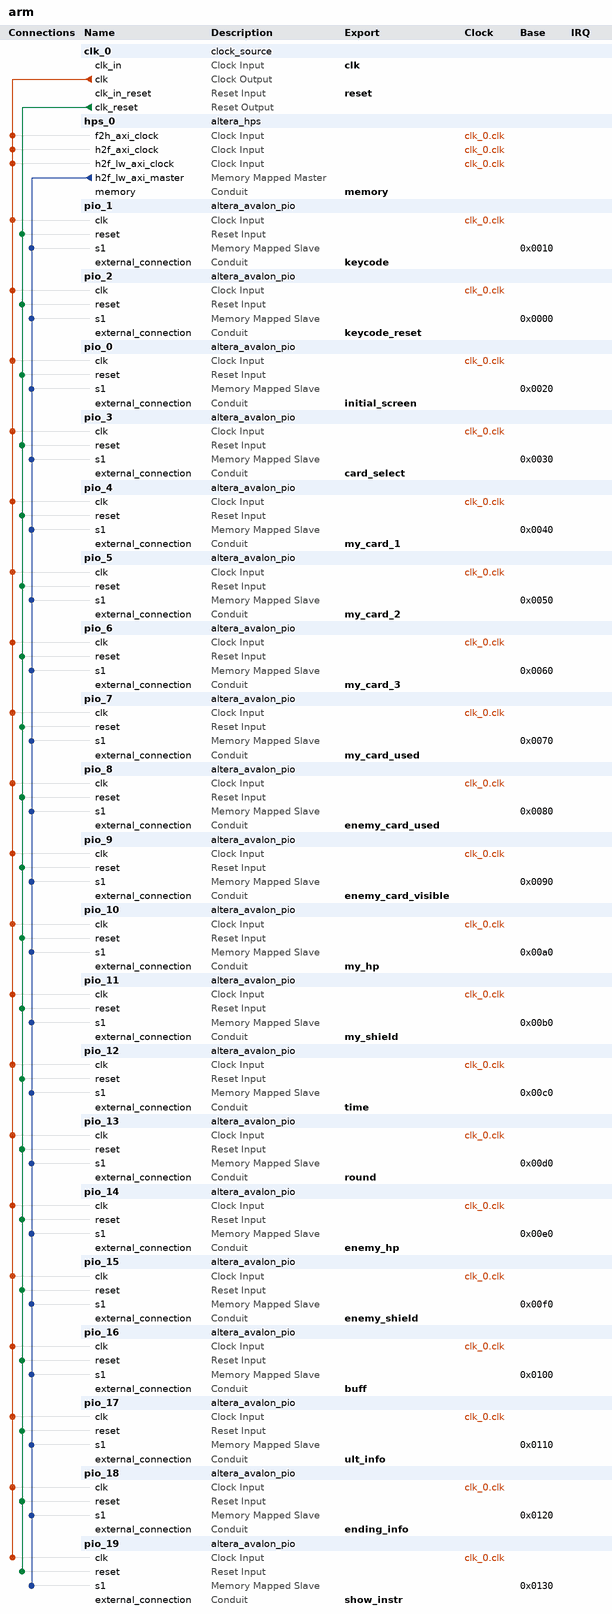
[diagram p0: system contents]
# Platform Designer (Qsys) system arm, Cyclone V 5CSEMA5F31C6
# Parameters at their usual value, and those the tool derives, are not listed.
package require -exact qsys 19.1
create_system arm
set_project_property DEVICE_FAMILY {Cyclone V}
set_project_property DEVICE 5CSEMA5F31C6

add_instance clk_0 clock_source 19.1
set_instance_parameter_value clk_0 clockFrequency 50000000

add_instance hps_0 altera_hps 19.1
set_instance_parameter_value hps_0 EMAC1_Mode N/A
set_instance_parameter_value hps_0 EMAC1_PinMuxing Unused
set_instance_parameter_value hps_0 F2SCLK_COLDRST_Enable false
set_instance_parameter_value hps_0 F2SCLK_DBGRST_Enable false
set_instance_parameter_value hps_0 F2SCLK_WARMRST_Enable false
set_instance_parameter_value hps_0 F2SINTERRUPT_Enable false
set_instance_parameter_value hps_0 F2S_Width 2
set_instance_parameter_value hps_0 FPGA_PERIPHERAL_OUTPUT_CLOCK_FREQ_EMAC0_GTX_CLK 125
set_instance_parameter_value hps_0 FPGA_PERIPHERAL_OUTPUT_CLOCK_FREQ_EMAC0_MD_CLK 2.5
set_instance_parameter_value hps_0 FPGA_PERIPHERAL_OUTPUT_CLOCK_FREQ_EMAC1_GTX_CLK 125
set_instance_parameter_value hps_0 FPGA_PERIPHERAL_OUTPUT_CLOCK_FREQ_EMAC1_MD_CLK 2.5
set_instance_parameter_value hps_0 HPS_PROTOCOL DDR3
set_instance_parameter_value hps_0 I2C0_Mode N/A
set_instance_parameter_value hps_0 I2C0_PinMuxing Unused
set_instance_parameter_value hps_0 I2C1_Mode N/A
set_instance_parameter_value hps_0 I2C1_PinMuxing Unused
set_instance_parameter_value hps_0 LWH2F_Enable true
set_instance_parameter_value hps_0 MEM_BANKADDR_WIDTH 3
set_instance_parameter_value hps_0 MEM_CLK_FREQ 400.0
set_instance_parameter_value hps_0 MEM_COL_ADDR_WIDTH 10
set_instance_parameter_value hps_0 MEM_DQ_WIDTH 32
set_instance_parameter_value hps_0 MEM_DRV_STR RZQ/6
set_instance_parameter_value hps_0 MEM_ROW_ADDR_WIDTH 15
set_instance_parameter_value hps_0 MEM_RTT_NOM RZQ/6
set_instance_parameter_value hps_0 MEM_RTT_WR {Dynamic ODT off}
set_instance_parameter_value hps_0 MEM_TCL 7
set_instance_parameter_value hps_0 MEM_TFAW_NS 45.0
set_instance_parameter_value hps_0 MEM_TRAS_NS 36.0
set_instance_parameter_value hps_0 MEM_TRCD_NS 13.125
set_instance_parameter_value hps_0 MEM_TRFC_NS 300.0
set_instance_parameter_value hps_0 MEM_TRP_NS 13.125
set_instance_parameter_value hps_0 MEM_VENDOR Micron
set_instance_parameter_value hps_0 MEM_WTCL 7
set_instance_parameter_value hps_0 QSPI_Mode N/A
set_instance_parameter_value hps_0 QSPI_PinMuxing Unused
set_instance_parameter_value hps_0 REF_CLK_FREQ 25.0
set_instance_parameter_value hps_0 S2FCLK_USER2CLK 5
set_instance_parameter_value hps_0 S2F_Width 3
set_instance_parameter_value hps_0 SDIO_Mode N/A
set_instance_parameter_value hps_0 SDIO_PinMuxing Unused
set_instance_parameter_value hps_0 SPIM1_Mode N/A
set_instance_parameter_value hps_0 SPIM1_PinMuxing Unused
set_instance_parameter_value hps_0 STM_Enable false
set_instance_parameter_value hps_0 TIMING_BOARD_AC_SKEW 0.02
set_instance_parameter_value hps_0 TIMING_BOARD_AC_TO_CK_SKEW 0.0
set_instance_parameter_value hps_0 TIMING_BOARD_DQ_TO_DQS_SKEW 0.0
set_instance_parameter_value hps_0 TIMING_BOARD_MAX_CK_DELAY 0.6
set_instance_parameter_value hps_0 TIMING_BOARD_MAX_DQS_DELAY 0.6
set_instance_parameter_value hps_0 TIMING_BOARD_SKEW_BETWEEN_DQS 0.02
set_instance_parameter_value hps_0 TIMING_BOARD_SKEW_CKDQS_DIMM_MAX 0.01
set_instance_parameter_value hps_0 TIMING_BOARD_SKEW_CKDQS_DIMM_MIN -0.01
set_instance_parameter_value hps_0 TIMING_BOARD_SKEW_WITHIN_DQS 0.02
set_instance_parameter_value hps_0 TIMING_TDH 65
set_instance_parameter_value hps_0 TIMING_TDQSCK 255
set_instance_parameter_value hps_0 TIMING_TDQSQ 125
set_instance_parameter_value hps_0 TIMING_TDS 30
set_instance_parameter_value hps_0 TIMING_TIH 140
set_instance_parameter_value hps_0 TIMING_TIS 190
set_instance_parameter_value hps_0 TIMING_TQSH 0.4
set_instance_parameter_value hps_0 UART0_Mode N/A
set_instance_parameter_value hps_0 UART0_PinMuxing Unused
set_instance_parameter_value hps_0 USB1_Mode N/A
set_instance_parameter_value hps_0 USB1_PinMuxing Unused
set_instance_parameter_value hps_0 desired_cfg_clk_mhz 100.0
set_instance_parameter_value hps_0 desired_qspi_clk_mhz 400.0

add_instance pio_1 altera_avalon_pio 19.1
set_instance_parameter_value pio_1 direction Input
set_instance_parameter_value pio_1 width 32

add_instance pio_2 altera_avalon_pio 19.1
set_instance_parameter_value pio_2 direction Output
set_instance_parameter_value pio_2 width 32

add_instance pio_0 altera_avalon_pio 19.1
set_instance_parameter_value pio_0 direction Output
set_instance_parameter_value pio_0 width 8

add_instance pio_3 altera_avalon_pio 19.1
set_instance_parameter_value pio_3 direction Output
set_instance_parameter_value pio_3 width 8

add_instance pio_4 altera_avalon_pio 19.1
set_instance_parameter_value pio_4 direction Output
set_instance_parameter_value pio_4 width 8

add_instance pio_5 altera_avalon_pio 19.1
set_instance_parameter_value pio_5 direction Output
set_instance_parameter_value pio_5 width 8

add_instance pio_6 altera_avalon_pio 19.1
set_instance_parameter_value pio_6 direction Output
set_instance_parameter_value pio_6 width 8

add_instance pio_7 altera_avalon_pio 19.1
set_instance_parameter_value pio_7 direction Output
set_instance_parameter_value pio_7 width 8

add_instance pio_8 altera_avalon_pio 19.1
set_instance_parameter_value pio_8 direction Output
set_instance_parameter_value pio_8 width 8

add_instance pio_9 altera_avalon_pio 19.1
set_instance_parameter_value pio_9 direction Output
set_instance_parameter_value pio_9 width 8

add_instance pio_10 altera_avalon_pio 19.1
set_instance_parameter_value pio_10 direction Output
set_instance_parameter_value pio_10 width 8

add_instance pio_11 altera_avalon_pio 19.1
set_instance_parameter_value pio_11 direction Output
set_instance_parameter_value pio_11 width 8

add_instance pio_12 altera_avalon_pio 19.1
set_instance_parameter_value pio_12 direction Output
set_instance_parameter_value pio_12 width 8

add_instance pio_13 altera_avalon_pio 19.1
set_instance_parameter_value pio_13 direction Output
set_instance_parameter_value pio_13 width 8

add_instance pio_14 altera_avalon_pio 19.1
set_instance_parameter_value pio_14 direction Output
set_instance_parameter_value pio_14 width 8

add_instance pio_15 altera_avalon_pio 19.1
set_instance_parameter_value pio_15 direction Output
set_instance_parameter_value pio_15 width 8

add_instance pio_16 altera_avalon_pio 19.1
set_instance_parameter_value pio_16 direction Output
set_instance_parameter_value pio_16 width 8

add_instance pio_17 altera_avalon_pio 19.1
set_instance_parameter_value pio_17 direction Output
set_instance_parameter_value pio_17 width 8

add_instance pio_18 altera_avalon_pio 19.1
set_instance_parameter_value pio_18 direction Output
set_instance_parameter_value pio_18 width 8

add_instance pio_19 altera_avalon_pio 19.1
set_instance_parameter_value pio_19 direction Output
set_instance_parameter_value pio_19 width 8

# connections
add_connection clk_0.clk hps_0.f2h_axi_clock clock
add_connection clk_0.clk hps_0.h2f_axi_clock clock
add_connection clk_0.clk hps_0.h2f_lw_axi_clock clock
add_connection clk_0.clk pio_0.clk clock
add_connection clk_0.clk pio_1.clk clock
add_connection clk_0.clk pio_2.clk clock
add_connection clk_0.clk pio_3.clk clock
add_connection clk_0.clk pio_4.clk clock
add_connection clk_0.clk pio_5.clk clock
add_connection clk_0.clk pio_6.clk clock
add_connection clk_0.clk pio_7.clk clock
add_connection clk_0.clk pio_8.clk clock
add_connection clk_0.clk pio_9.clk clock
add_connection clk_0.clk pio_10.clk clock
add_connection clk_0.clk pio_11.clk clock
add_connection clk_0.clk pio_12.clk clock
add_connection clk_0.clk pio_13.clk clock
add_connection clk_0.clk pio_14.clk clock
add_connection clk_0.clk pio_15.clk clock
add_connection clk_0.clk pio_16.clk clock
add_connection clk_0.clk pio_17.clk clock
add_connection clk_0.clk pio_18.clk clock
add_connection clk_0.clk pio_19.clk clock
add_connection clk_0.clk_reset pio_0.reset reset
add_connection clk_0.clk_reset pio_1.reset reset
add_connection clk_0.clk_reset pio_2.reset reset
add_connection clk_0.clk_reset pio_3.reset reset
add_connection clk_0.clk_reset pio_4.reset reset
add_connection clk_0.clk_reset pio_5.reset reset
add_connection clk_0.clk_reset pio_6.reset reset
add_connection clk_0.clk_reset pio_7.reset reset
add_connection clk_0.clk_reset pio_8.reset reset
add_connection clk_0.clk_reset pio_9.reset reset
add_connection clk_0.clk_reset pio_10.reset reset
add_connection clk_0.clk_reset pio_11.reset reset
add_connection clk_0.clk_reset pio_12.reset reset
add_connection clk_0.clk_reset pio_13.reset reset
add_connection clk_0.clk_reset pio_14.reset reset
add_connection clk_0.clk_reset pio_15.reset reset
add_connection clk_0.clk_reset pio_16.reset reset
add_connection clk_0.clk_reset pio_17.reset reset
add_connection clk_0.clk_reset pio_18.reset reset
add_connection clk_0.clk_reset pio_19.reset reset
add_connection hps_0.h2f_lw_axi_master pio_0.s1 avalon
set_connection_parameter_value hps_0.h2f_lw_axi_master/pio_0.s1 baseAddress 0x0020
add_connection hps_0.h2f_lw_axi_master pio_1.s1 avalon
set_connection_parameter_value hps_0.h2f_lw_axi_master/pio_1.s1 baseAddress 0x0010
add_connection hps_0.h2f_lw_axi_master pio_2.s1 avalon
set_connection_parameter_value hps_0.h2f_lw_axi_master/pio_2.s1 baseAddress 0x0000
add_connection hps_0.h2f_lw_axi_master pio_3.s1 avalon
set_connection_parameter_value hps_0.h2f_lw_axi_master/pio_3.s1 baseAddress 0x0030
add_connection hps_0.h2f_lw_axi_master pio_4.s1 avalon
set_connection_parameter_value hps_0.h2f_lw_axi_master/pio_4.s1 baseAddress 0x0040
add_connection hps_0.h2f_lw_axi_master pio_5.s1 avalon
set_connection_parameter_value hps_0.h2f_lw_axi_master/pio_5.s1 baseAddress 0x0050
add_connection hps_0.h2f_lw_axi_master pio_6.s1 avalon
set_connection_parameter_value hps_0.h2f_lw_axi_master/pio_6.s1 baseAddress 0x0060
add_connection hps_0.h2f_lw_axi_master pio_7.s1 avalon
set_connection_parameter_value hps_0.h2f_lw_axi_master/pio_7.s1 baseAddress 0x0070
add_connection hps_0.h2f_lw_axi_master pio_8.s1 avalon
set_connection_parameter_value hps_0.h2f_lw_axi_master/pio_8.s1 baseAddress 0x0080
add_connection hps_0.h2f_lw_axi_master pio_9.s1 avalon
set_connection_parameter_value hps_0.h2f_lw_axi_master/pio_9.s1 baseAddress 0x0090
add_connection hps_0.h2f_lw_axi_master pio_10.s1 avalon
set_connection_parameter_value hps_0.h2f_lw_axi_master/pio_10.s1 baseAddress 0x00a0
add_connection hps_0.h2f_lw_axi_master pio_11.s1 avalon
set_connection_parameter_value hps_0.h2f_lw_axi_master/pio_11.s1 baseAddress 0x00b0
add_connection hps_0.h2f_lw_axi_master pio_12.s1 avalon
set_connection_parameter_value hps_0.h2f_lw_axi_master/pio_12.s1 baseAddress 0x00c0
add_connection hps_0.h2f_lw_axi_master pio_13.s1 avalon
set_connection_parameter_value hps_0.h2f_lw_axi_master/pio_13.s1 baseAddress 0x00d0
add_connection hps_0.h2f_lw_axi_master pio_14.s1 avalon
set_connection_parameter_value hps_0.h2f_lw_axi_master/pio_14.s1 baseAddress 0x00e0
add_connection hps_0.h2f_lw_axi_master pio_15.s1 avalon
set_connection_parameter_value hps_0.h2f_lw_axi_master/pio_15.s1 baseAddress 0x00f0
add_connection hps_0.h2f_lw_axi_master pio_16.s1 avalon
set_connection_parameter_value hps_0.h2f_lw_axi_master/pio_16.s1 baseAddress 0x0100
add_connection hps_0.h2f_lw_axi_master pio_17.s1 avalon
set_connection_parameter_value hps_0.h2f_lw_axi_master/pio_17.s1 baseAddress 0x0110
add_connection hps_0.h2f_lw_axi_master pio_18.s1 avalon
set_connection_parameter_value hps_0.h2f_lw_axi_master/pio_18.s1 baseAddress 0x0120
add_connection hps_0.h2f_lw_axi_master pio_19.s1 avalon
set_connection_parameter_value hps_0.h2f_lw_axi_master/pio_19.s1 baseAddress 0x0130

# exported interfaces
add_interface buff conduit end
set_interface_property buff EXPORT_OF pio_16.external_connection
add_interface card_select conduit end
set_interface_property card_select EXPORT_OF pio_3.external_connection
add_interface clk clock sink
set_interface_property clk EXPORT_OF clk_0.clk_in
add_interface ending_info conduit end
set_interface_property ending_info EXPORT_OF pio_18.external_connection
add_interface enemy_card_used conduit end
set_interface_property enemy_card_used EXPORT_OF pio_8.external_connection
add_interface enemy_card_visible conduit end
set_interface_property enemy_card_visible EXPORT_OF pio_9.external_connection
add_interface enemy_hp conduit end
set_interface_property enemy_hp EXPORT_OF pio_14.external_connection
add_interface enemy_shield conduit end
set_interface_property enemy_shield EXPORT_OF pio_15.external_connection
add_interface initial_screen conduit end
set_interface_property initial_screen EXPORT_OF pio_0.external_connection
add_interface keycode conduit end
set_interface_property keycode EXPORT_OF pio_1.external_connection
add_interface keycode_reset conduit end
set_interface_property keycode_reset EXPORT_OF pio_2.external_connection
add_interface memory conduit end
set_interface_property memory EXPORT_OF hps_0.memory
add_interface my_card_1 conduit end
set_interface_property my_card_1 EXPORT_OF pio_4.external_connection
add_interface my_card_2 conduit end
set_interface_property my_card_2 EXPORT_OF pio_5.external_connection
add_interface my_card_3 conduit end
set_interface_property my_card_3 EXPORT_OF pio_6.external_connection
add_interface my_card_used conduit end
set_interface_property my_card_used EXPORT_OF pio_7.external_connection
add_interface my_hp conduit end
set_interface_property my_hp EXPORT_OF pio_10.external_connection
add_interface my_shield conduit end
set_interface_property my_shield EXPORT_OF pio_11.external_connection
add_interface reset reset sink
set_interface_property reset EXPORT_OF clk_0.clk_in_reset
add_interface round conduit end
set_interface_property round EXPORT_OF pio_13.external_connection
add_interface show_instr conduit end
set_interface_property show_instr EXPORT_OF pio_19.external_connection
add_interface time conduit end
set_interface_property time EXPORT_OF pio_12.external_connection
add_interface ult_info conduit end
set_interface_property ult_info EXPORT_OF pio_17.external_connection

set_interconnect_requirement {$system} qsys_mm.clockCrossingAdapter HANDSHAKE
set_interconnect_requirement {$system} qsys_mm.enableEccProtection FALSE
set_interconnect_requirement {$system} qsys_mm.insertDefaultSlave FALSE
set_interconnect_requirement {$system} qsys_mm.maxAdditionalLatency 1

save_system arm.qsys
